# EAGLE schematic ME_433_Final (EAGLE 7.5.0)
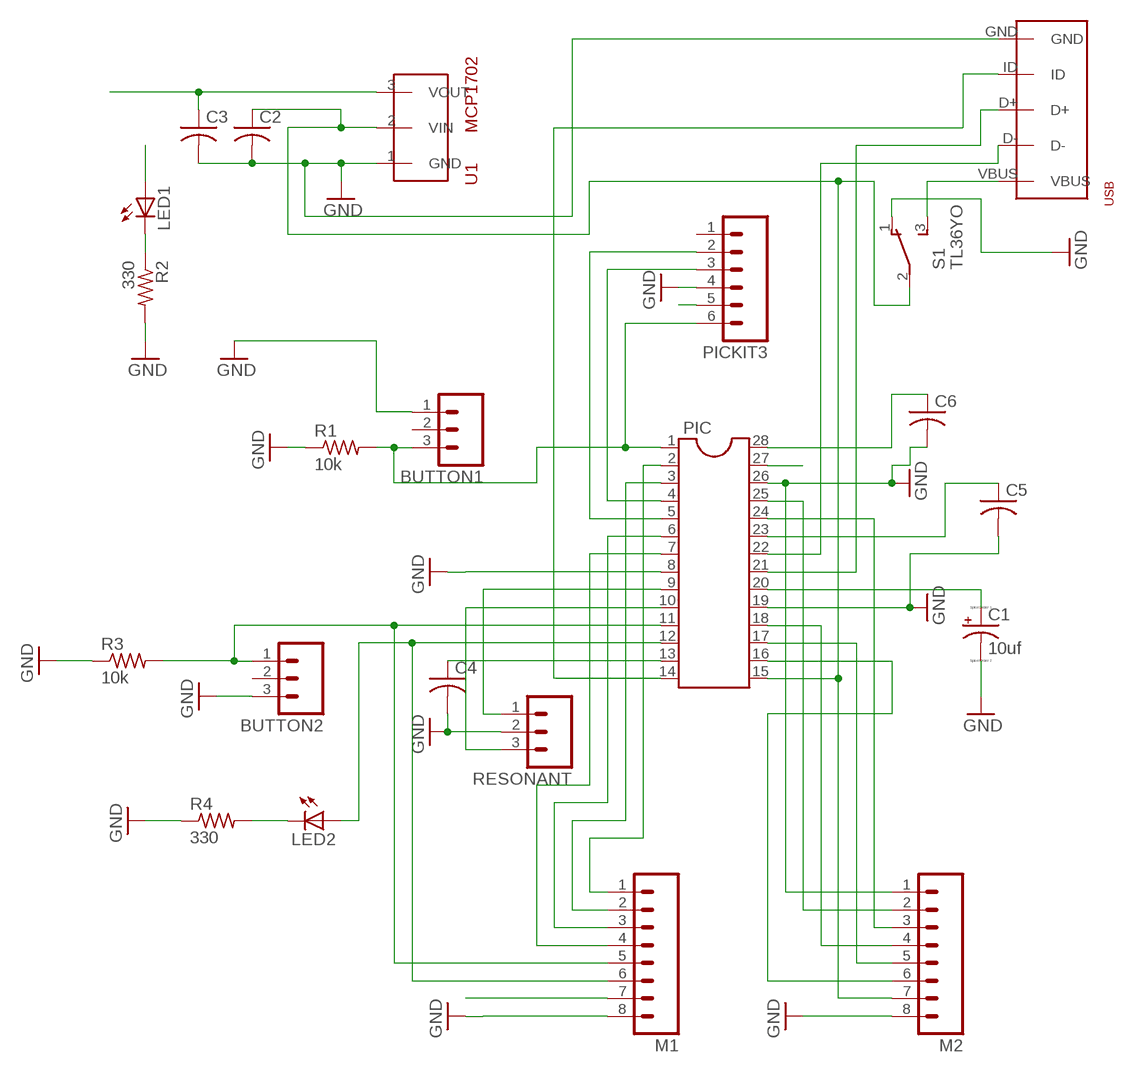
[diagram p0: schematic, sheet 1]

## Parts
BUTTON1  M03PTH  [1X03]
BUTTON2  M03PTH  [1X03]
C1  10uf  CPOL-USE5-10.5  [E5-10,5]
C2  C-US025-025X050  [C025-025X050]
C3  C-US025-025X050  [C025-025X050]
C4  C-US025-025X050  [C025-025X050]
C5  C-US025-025X050  [C025-025X050]
C6  C-US025-025X050  [C025-025X050]
LED1  LED3MM  [LED3MM]
LED2  LED3MM  [LED3MM]
M1  M08SILK_FEMALE_PTH  [1X08]
M2  M08SILK_FEMALE_PTH  [1X08]
PIC  DIL28-3  [DIL28-3]
PICKIT3  M06SILK_FEMALE_PTH  [1X06]
R1  10k  R-US_0309/12  [0309/12]
R2  330  R-US_0309/12  [0309/12]
R3  10k  R-US_0309/12  [0309/12]
R4  330  R-US_0309/12  [0309/12]
RESONANT  M03PTH  [1X03]
S1  TL36YO  [TL3XYO]
U$1  MCP1702TO92  [TO92]
U$2  USB_ME  [USB-MB-H]

## Nets
3.3V: C3.1 C4.1 C5.1 C6.1 LED1.A M1.7 PIC.13 PIC.23 PIC.28 PICKIT3.5 U$1.3(VOUT)
GND: BUTTON1.1 BUTTON2.3 C1.- C2.2 C3.2 C4.2 C5.2 C6.2 M1.8 M2.1 M2.8 PIC.8 PIC.19 PIC.26 PICKIT3.4 R1.1 R2.2 R3.1 R4.1 RESONANT.2 S1.1(O) U$1.1(GND) U$2.GND
N$1: BUTTON1.3 PIC.1 PICKIT3.6 R1.2
N$2: PIC.4 PICKIT3.3
N$3: C2.1 M2.7 PIC.15 S1.2(P) U$1.2(VIN)
N$4: LED1.K(C) R2.1
N$5: PIC.5 PICKIT3.2
N$6: PIC.9 RESONANT.1
N$7: PIC.10 RESONANT.3
N$8: BUTTON2.1 M1.5 PIC.11 R3.2
N$9: PIC.14 U$2.ID
N$10: LED2.A M1.6 PIC.12
N$11: LED2.K(C) R4.2
N$12: C1.+ PIC.20
N$13: PIC.27
N$14: PIC.21 U$2.D+
N$15: PIC.22 U$2.D-
N$16: M1.1 PIC.2
N$17: M1.2 PIC.3
N$18: M1.3 PIC.6
N$19: M1.4 PIC.7
N$20: M2.2 PIC.25
N$21: M2.3 PIC.24
N$22: M2.4 PIC.18
N$23: M2.5 PIC.17
N$24: M2.6 PIC.16
N$25: S1.3(S) U$2.VBUS
Unconnected: BUTTON1.2 BUTTON2.2 PICKIT3.1

## Library data of the parts
BUTTON1 BUTTON2 RESONANT = ME_433:M03: Header 3 Standard 3-pin 0.1" header. Use with straight break away headers (SKU : PRT-00116), right angle break away headers (PRT-00553), swiss pins (PRT-00743), machine pins (PRT-00117), and female headers (PRT-00115). Molex polarized connector foot print use with SKU : PRT-08232 with associated crimp pins and housings.
C1 = ME_433:CPOL-US: POLARIZED CAPACITOR, American symbol
C2-C6 = ME_433:C-US: CAPACITOR, American symbol
LED1 LED2 = ME_433:LED: LED OSRAM: - CHIPLED LG R971, LG N971, LY N971, LG Q971, LY Q971, LO R971, LY R971 LH N974, LH R974 LS Q976, LO Q976, LY Q976 LO Q996 - Hyper CHIPLED LW Q18S LB Q993, LB Q99A, LB R99A - SideLED LS A670, LO A670, LY A670, LG A670, LP A670 LB A673, LV A673, LT A673, LW A673 LH A674 LY A675 LS A676, LA A676, LO A676, LY A676, LW A676 LS A679, LY A679, LG A679 - Hyper Micro SIDELED® LS Y876, LA Y876, LO Y876, LY Y876 LT Y87S - SmartLED LW L88C, LW L88S LB L89C, LB L89S, LG L890 LS L89K, LO L89K, LY L89K LS L896, LA L896, LO L896, LY L896 - TOPLED LS T670, LO T670, LY T670, LG T670, LP T670 LSG T670, LSP T670, LSY T670, LOP T670, LYG T670 LG T671, LOG T671, LSG T671 LB T673, LV T673, LT T673, LW T673 LH T674 LS T676, LA T676, LO T676, LY T676, LB T676, LH T676, LSB T676, LW T676 LB T67C, LV T67C, LT T67C, LS T67K, LO T67K, LY T67K, LW E67C LS E67B, LA E67B, LO E67B, LY E67B, LB E67C, LV E67C, LT E67C LW T67C LS T679, LY T679, LG T679 LS T770, LO T770, LY T770, LG T770, LP T770 LB T773, LV T773, LT T773, LW T773 LH T774 LS E675, LA E675, LY E675, LS T675 LS T776, LA T776, LO T776, LY T776, LB T776 LHGB T686 LT T68C, LB T68C - Hyper Mini TOPLED® LB M676 - Mini TOPLED Santana® LG M470 LS M47K, LO M47K, LY M47K Source: http://www.osram.convergy.de LUXEON: - LUMILED® LXK2-PW12-R00, LXK2-PW12-S00, LXK2-PW14-U00, LXK2-PW14-V00 LXK2-PM12-R00, LXK2-PM12-S00, LXK2-PM14-U00 LXK2-PE12-Q00, LXK2-PE12-R00, LXK2-PE12-S00, LXK2-PE14-T00, LXK2-PE14-U00 LXK2-PB12-K00, LXK2-PB12-L00, LXK2-PB12-M00, LXK2-PB14-N00, LXK2-PB14-P00, LXK2-PB14-Q00 LXK2-PR12-L00, LXK2-PR12-M00, LXK2-PR14-Q00, LXK2-PR14-R00 LXK2-PD12-Q00, LXK2-PD12-R00, LXK2-PD12-S00 LXK2-PH12-R00, LXK2-PH12-S00 LXK2-PL12-P00, LXK2-PL12-Q00, LXK2-PL12-R00 Source: www.luxeon.com KINGBRIGHT: KA-3528ASYC Source: www.kingbright.com
M1 M2 = ME_433:M08: Header 8 Standard 8-pin 0.1" header. Use with straight break away headers (SKU : PRT-00116), right angle break away headers (PRT-00553), swiss pins (PRT-00743), machine pins (PRT-00117), and female headers (PRT-00115).; PROD_ID: CONN-08438
PIC = ME_433:DIL28: Dual In Line
PICKIT3 = ME_433:M06: Header 6 Standard 6-pin 0.1" header. Use with straight break away headers (SKU : PRT-00116), right angle break away headers (PRT-00553), swiss pins (PRT-00743), machine pins (PRT-00117), and female headers (PRT-00115). Molex polarized connector foot print use with SKU : PRT-08094 with associated crimp pins and housings. NOTES ON THE VARIANTS LOCK and LOCK_LONGPADS... This footprint was designed to help hold the alignment of a through-hole component (i.e. 6-pin header) while soldering it into place. You may notice that each hole has been shifted either up or down by 0.005 of an inch from it's more standard position (which is a perfectly straight line). This slight alteration caused the pins (the squares in the middle) to touch the edges of the holes. Because they are alternating, it causes a "brace" to hold the component in place. 0.005 has proven to be the perfect amount of "off-center" position when using our standard breakaway headers. Although looks a little odd when you look at the bare footprint, once you have a header in there, the alteration is very hard to notice. Also,if you push a header all the way into place, it is covered up entirely on the bottom side. This idea of altering the position of holes to aid alignment will be further integrated into the Sparkfun Library for other footprints. It can help hold any component with 3 or more connection pins.; PROD_ID: CONN-08437
R1-R4 = ME_433:R-US_: RESISTOR, American symbol
S1 = ME_433:TL36YO: TINY SWITCH ON - ON Source: http://www2.produktinfo.conrad.com/datenblaetter/700000-724999/705152-da-01-de-Subminiaturschalter_TL_36YO.pdf
U$1 = ME_433:MCP1702
U$2 = ME_433:USB_ME